# Altium schematic sheet 701_GridPos7.SchDoc
size A2; Organization: Greenfield Tech Solutions; Address1: Molendreef 33; Address2: Ossendrecht; Address3: 4641CS; Address4: The Netherlands; SheetNumber: 7; SheetTotal: 7
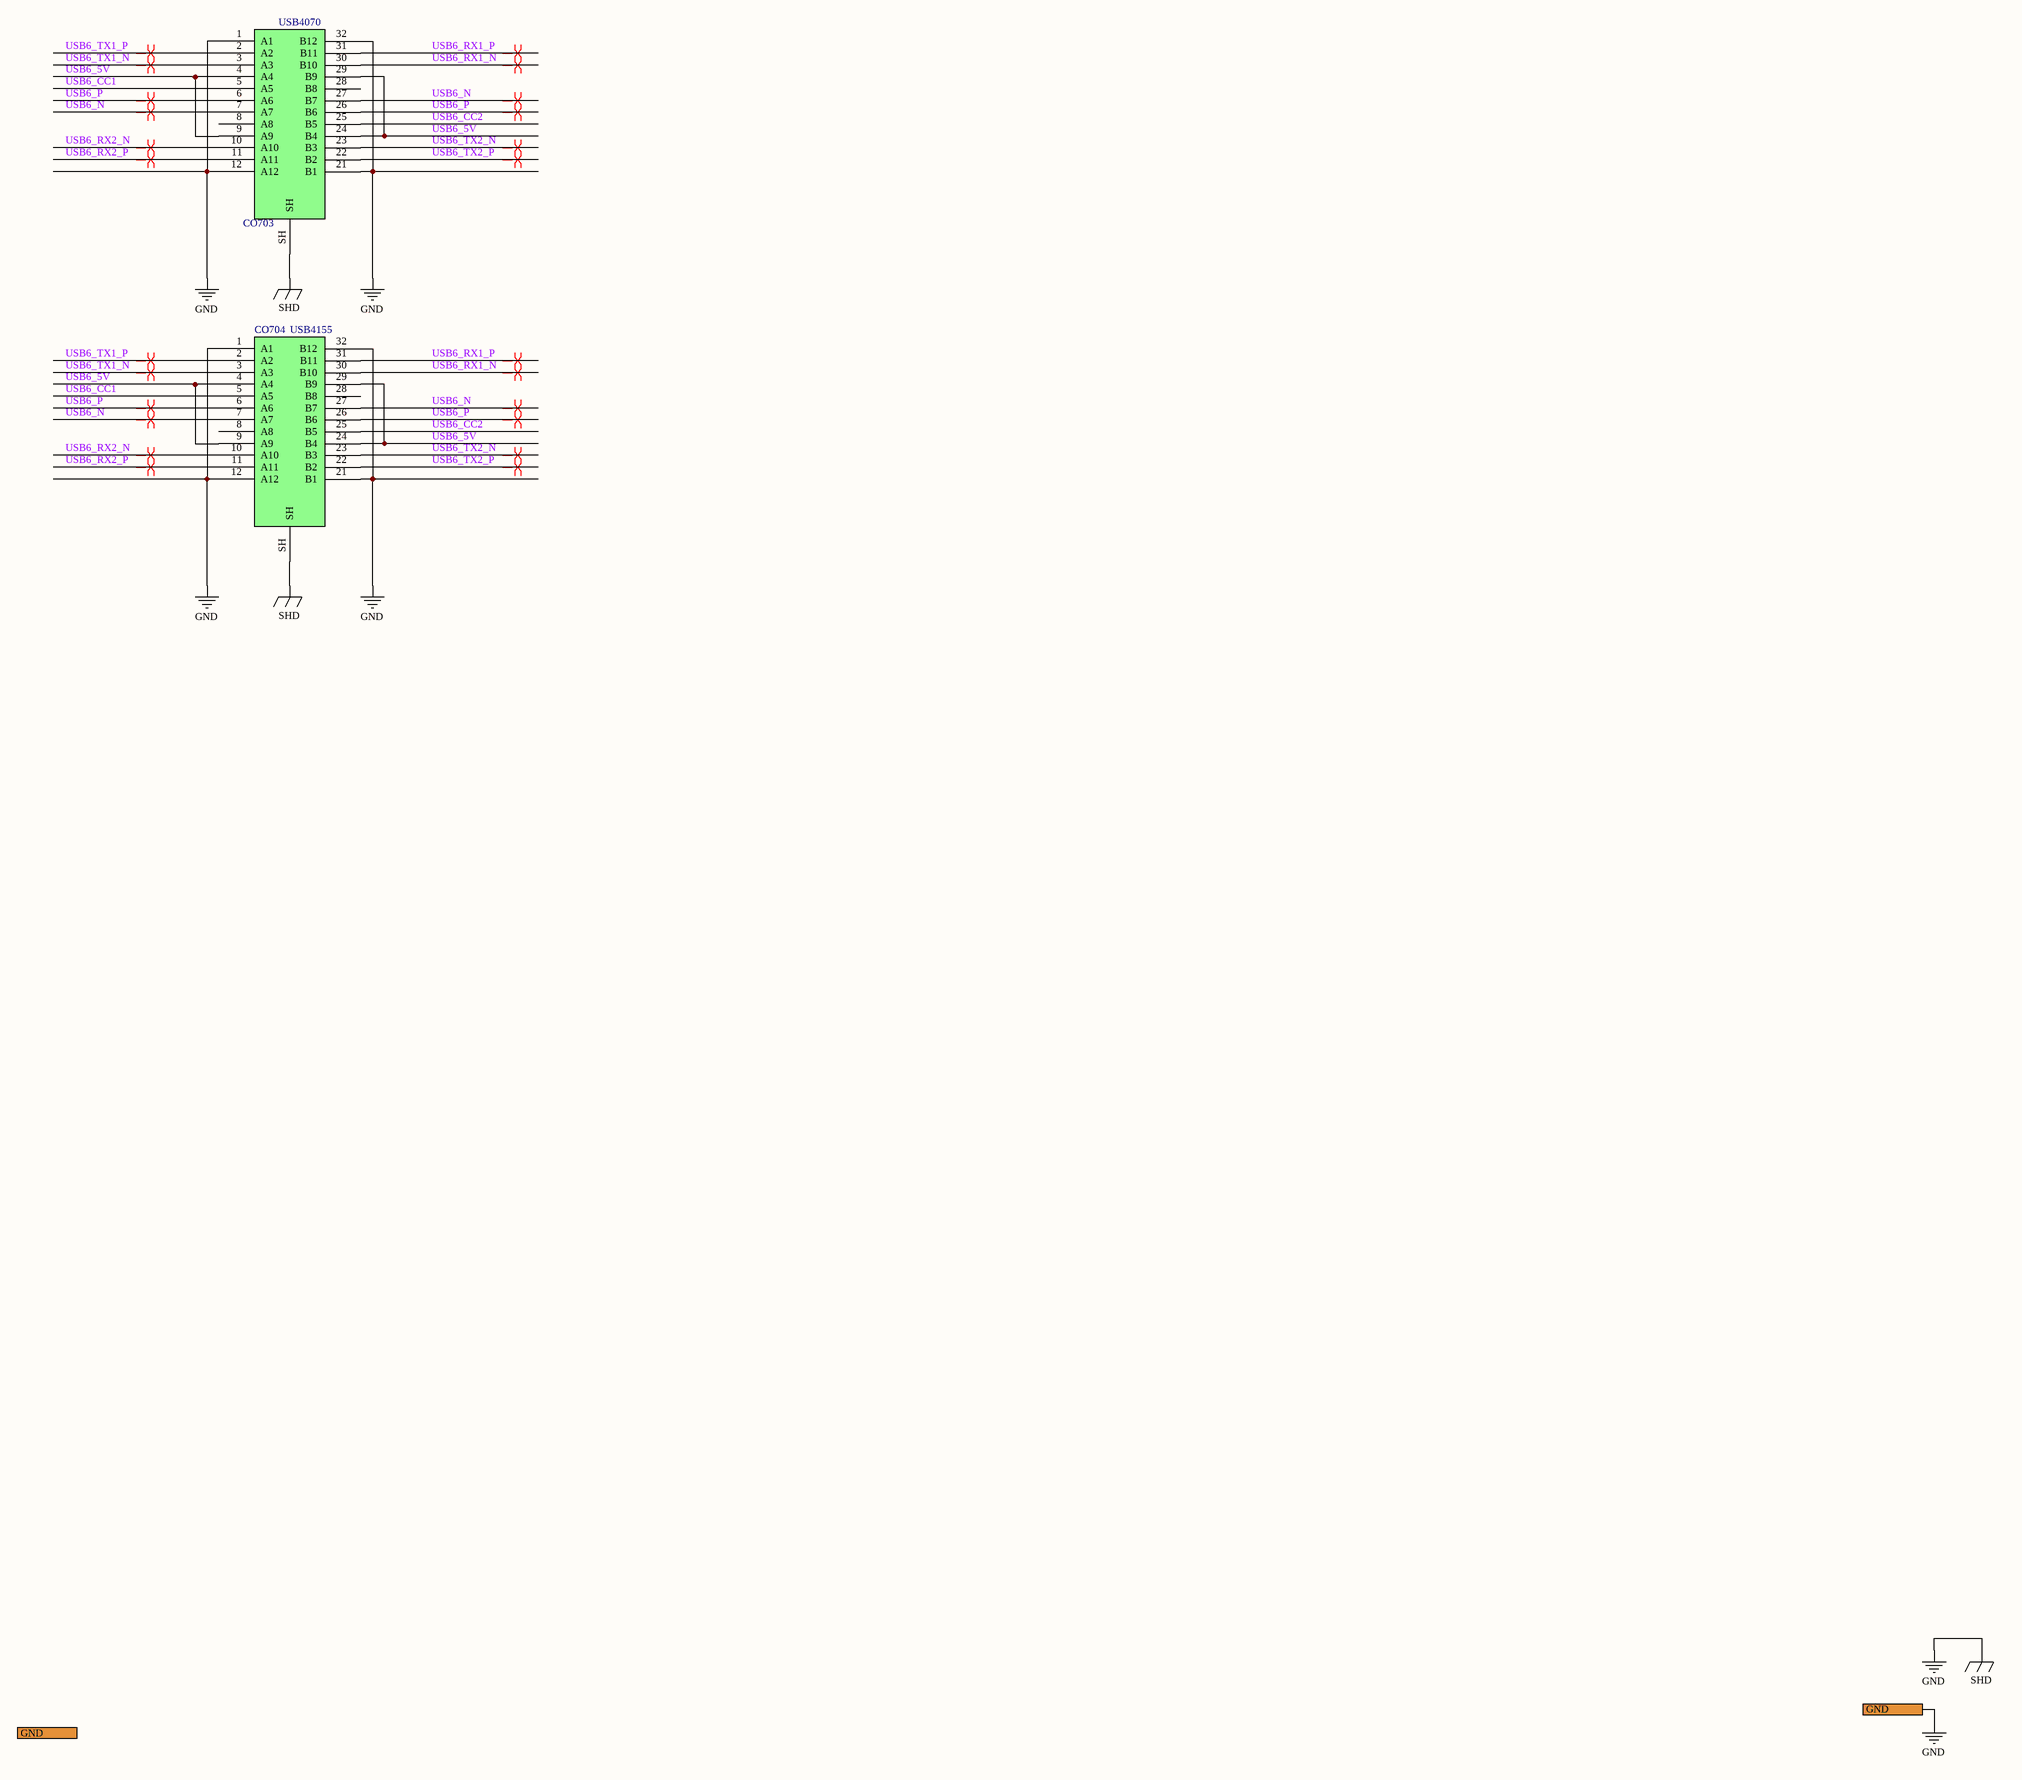
[diagram p0: 701_GridPos7.SchDoc]

## Parts
CO703  USB4070  [USB4070-30-C]
CO704  USB4155  [USB4155-03-C]

## Ports
GND

## Nets
GND: CO703.1(A1) CO703.12(A12) CO703.21(B1) CO703.32(B12) CO703.SH CO704.1(A1) CO704.12(A12) CO704.21(B1) CO704.32(B12) CO704.SH ; port GND  [also labelled SHD]
USB6_5V: CO703.4(A4) CO703.9(A9) CO703.24(B4) CO703.29(B9) CO704.4(A4) CO704.9(A9) CO704.24(B4) CO704.29(B9)
USB6_CC1: CO703.5(A5) CO704.5(A5)
USB6_CC2: CO703.25(B5) CO704.25(B5)
USB6_N: CO703.7(A7) CO703.27(B7) CO704.7(A7) CO704.27(B7)
USB6_P: CO703.6(A6) CO703.26(B6) CO704.6(A6) CO704.26(B6)
USB6_RX1_N: CO703.30(B10) CO704.30(B10)
USB6_RX1_P: CO703.31(B11) CO704.31(B11)
USB6_RX2_N: CO703.10(A10) CO704.10(A10)
USB6_RX2_P: CO703.11(A11) CO704.11(A11)
USB6_TX1_N: CO703.3(A3) CO704.3(A3)
USB6_TX1_P: CO703.2(A2) CO704.2(A2)
USB6_TX2_N: CO703.23(B3) CO704.23(B3)
USB6_TX2_P: CO703.22(B2) CO704.22(B2)

Not connected (* = marked no-connect by the designer): CO703 8(A8) 28(B8); CO704 8(A8) 28(B8)

## Layout directives
differential pair; differential pair class USB3: USB6_N, USB6_P, USB6_RX1_N, USB6_RX1_P, USB6_RX2_N, USB6_RX2_P, USB6_TX1_N, USB6_TX1_P, USB6_TX2_N, USB6_TX2_P

## Notes on the sheet
- Title
- Size:
- Date:
- File:
- A2
- Number:
- Time:
- Revision:
- Sheet
- of

## Library data of the parts
CO703 = CO0021: USB C connector Receptacle Vertical; Part Number: CO0021; ID: 16; RefVal: USB4070; ManfactPart: USB4070-30-C
CO704 = CO0031: USB C connector Plug Horizontal; Part Number: CO0031; ID: 30; RefVal: USB4155; ManfactPart: USB4155-03-C